# EAGLE design pcb (EAGLE 9.4.0)
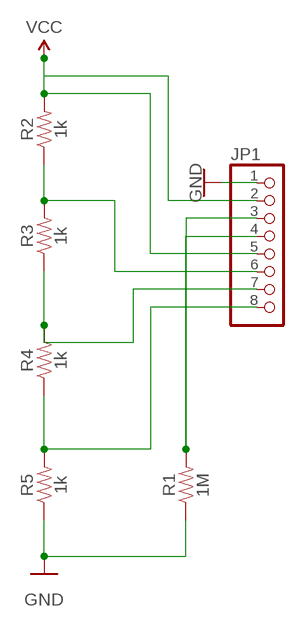
[diagram p0: schematic, sheet 1]

## Parts
JP1  PINHD-1X8-3.5MM  [1X08-3.5MM]
R1  1M  1MOHM-HORIZ-1/6W-5%  [AXIAL-0.3]
R2  1k  1KOHM-HORIZ-1/4W-5%  [AXIAL-0.3]
R3  1k  1KOHM-HORIZ-1/4W-5%  [AXIAL-0.3]
R4  1k  1KOHM-HORIZ-1/4W-5%  [AXIAL-0.3]
R5  1k  1KOHM-HORIZ-1/4W-5%  [AXIAL-0.3]

## Nets
GND: JP1.1 R1.P$1 R5.P$1
N$1: JP1.8 R4.P$1 R5.P$2
N$2: JP1.7 R3.P$1 R4.P$2
N$3: JP1.6 R2.P$1 R3.P$2
N$6: JP1.3 JP1.4 R1.P$2
VCC: JP1.2 JP1.5 R2.P$2

## Library data of the parts
JP1 = adafruit:PINHD-1X8: PIN HEADER
R1 = SparkFun-Resistors:1MOHM: 1MΩ resistor A resistor is a passive two-terminal electrical component that implements electrical resistance as a circuit element. Resistors act to reduce current flow, and, at the same time, act to lower voltage levels within circuits. - Wikipedia; PROD_ID: RES-09559
R2-R5 = SparkFun-Resistors:1KOHM: 1kΩ resistor A resistor is a passive two-terminal electrical component that implements electrical resistance as a circuit element. Resistors act to reduce current flow, and, at the same time, act to lower voltage levels within circuits. - Wikipedia; PROD_ID: RES-08380

## Net classes
0 default: width 0.305 mm, drill 0.508 mm, clearance 0.254 mm

## Board
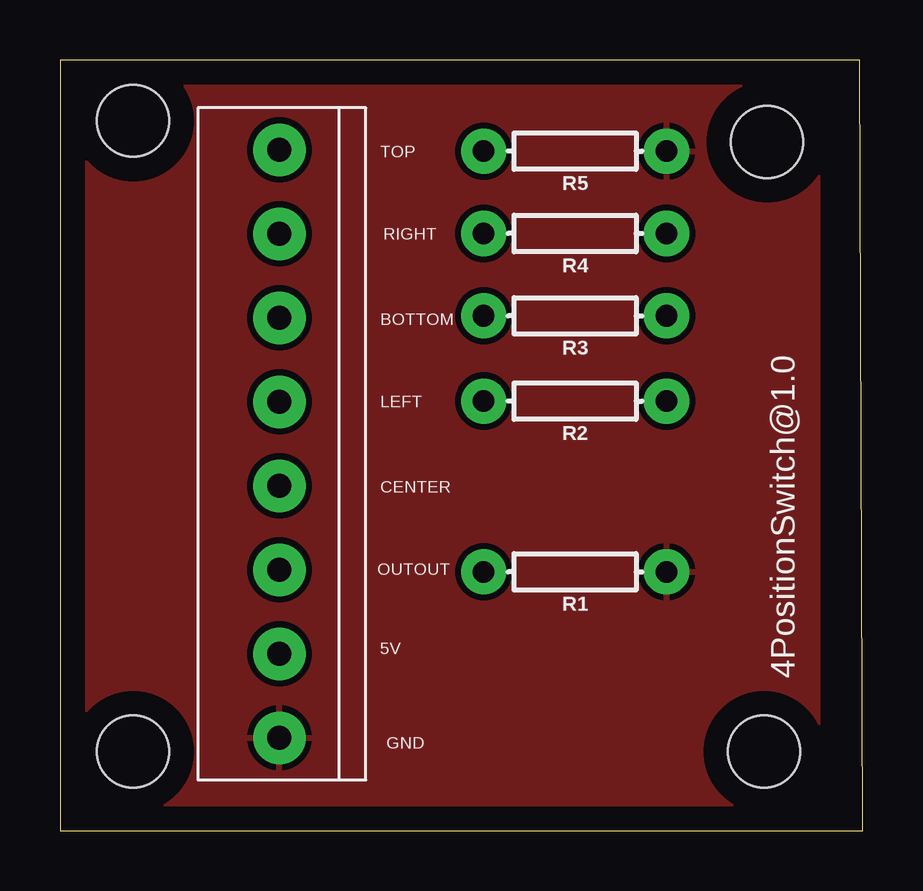
[diagram p1: board, top side]
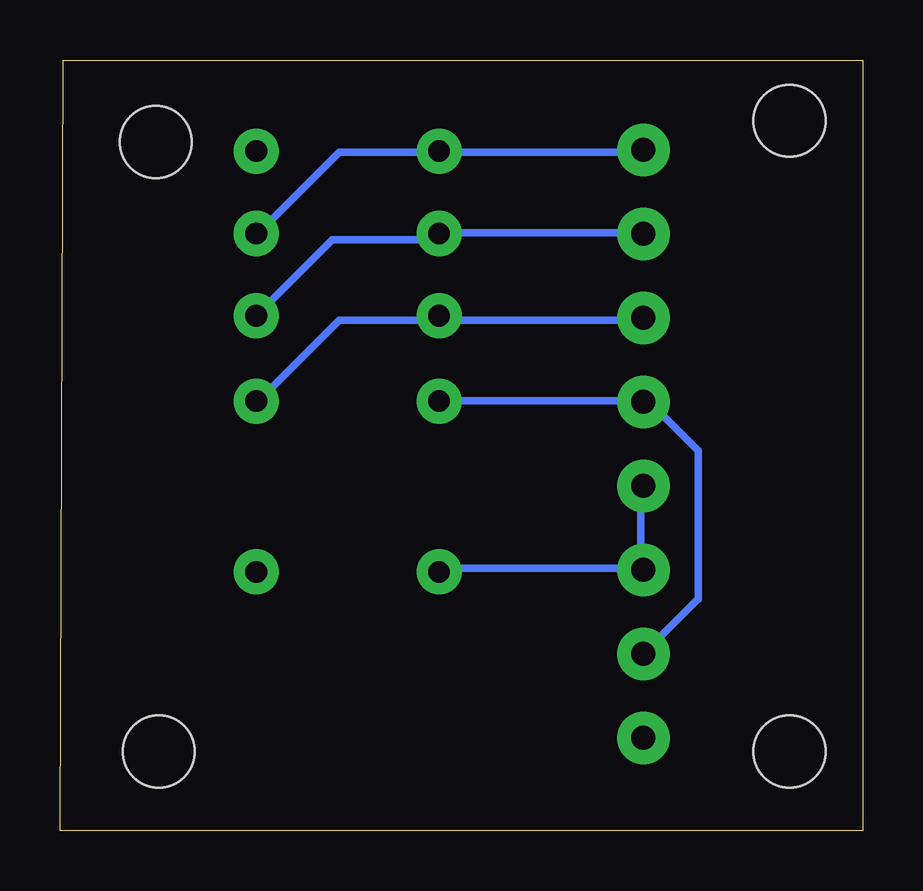
[diagram p2: board, bottom side, seen from below]

Size 33.45 x 32.12 mm. Coordinates in mm from the lower left corner, seen from the top.
Outline: 0,0 33.45,0 33.33,32.12 0,32.12 0,0
Copper layers (1*16): Top 0.035mm / dielectric 1.5mm / Bottom 0.035mm
Design rules "default": minimum track width 6mil, minimum drill 0.35mm, track to track 6mil, track to pad 6mil, pad to pad 6mil, via to via 6mil, smd to smd 6mil, copper to edge 40mil, drill to drill 6mil, minimum pad ring 10mil, minimum via ring 8mil, stop-mask expansion 4mil, vias tented up to drill 0mil, thermal gap 10mil
Holes 3 mm at 29.34,3.3 29.46,28.7 3.05,29.59 3.05,3.3

### Footprints (pad centres in the part's own frame; a part is rotated, then mirrored left to right if it is on the bottom)
1X08-3.5MM = drill 1 pad 2.184: 1 -12.25,0; 2 -8.75,0; 3 -5.25,0; 4 -1.75,0; 5 1.75,0; 6 5.25,0; 7 8.75,0; 8 12.25,0
AXIAL-0.3 = drill 0.9 pad 1.88: P$1 -3.81,0; P$2 3.81,0

### Placement (x,y rotation side)
JP1  9.14,16.13 90 top
R1  21.46,10.8 180 top
R2  21.46,17.91 180 top
R3  21.46,21.46 180 top
R4  21.46,24.89 180 top
R5  21.46,28.32 180 top

### Tracks (layer width: path | path; a pad name or v marks a point on that pad's centre or on a via)
GND
  pour Top: -0.13,31.37 31.62,31.37 31.62,0.76 -0.13,0.76
N$1
  Bottom 0.305: R4.P$1 25.17,24.92 21.82,28.27 17.91,28.27 R5.P$2 17.63,28.27 9.37,28.27 JP1.8
N$2
  Bottom 0.305: R3.P$1 22.1,24.64 17.91,24.64 R4.P$2 17.63,24.92 9.37,24.92 JP1.7
N$3
  Bottom 0.305: R2.P$1 25.17,17.93 21.82,21.28 17.91,21.28 R3.P$2 17.63,21.28 9.37,21.28 JP1.6
N$6
  Bottom 0.305: 9.37,10.95 9.25,10.95 9.25,13.45 9.14,13.75 JP1.4 | 9.37,10.95 17.63,10.95 R1.P$2 | 9.37,10.95 JP1.3
VCC
  Bottom 0.305: R2.P$2 17.63,17.93 9.37,17.93 JP1.5 8.89,17.88 6.86,15.85 6.86,9.64 6.88,9.65 JP1.2

### Text on the board
tNames: TOP | RIGHT | BOTTOM | LEFT | CENTER | OUTOUT | 5V | 4PositionSwitch@1.0 | GND